# Altium project Arbitrary-Waveform-Generator.PrjPcb
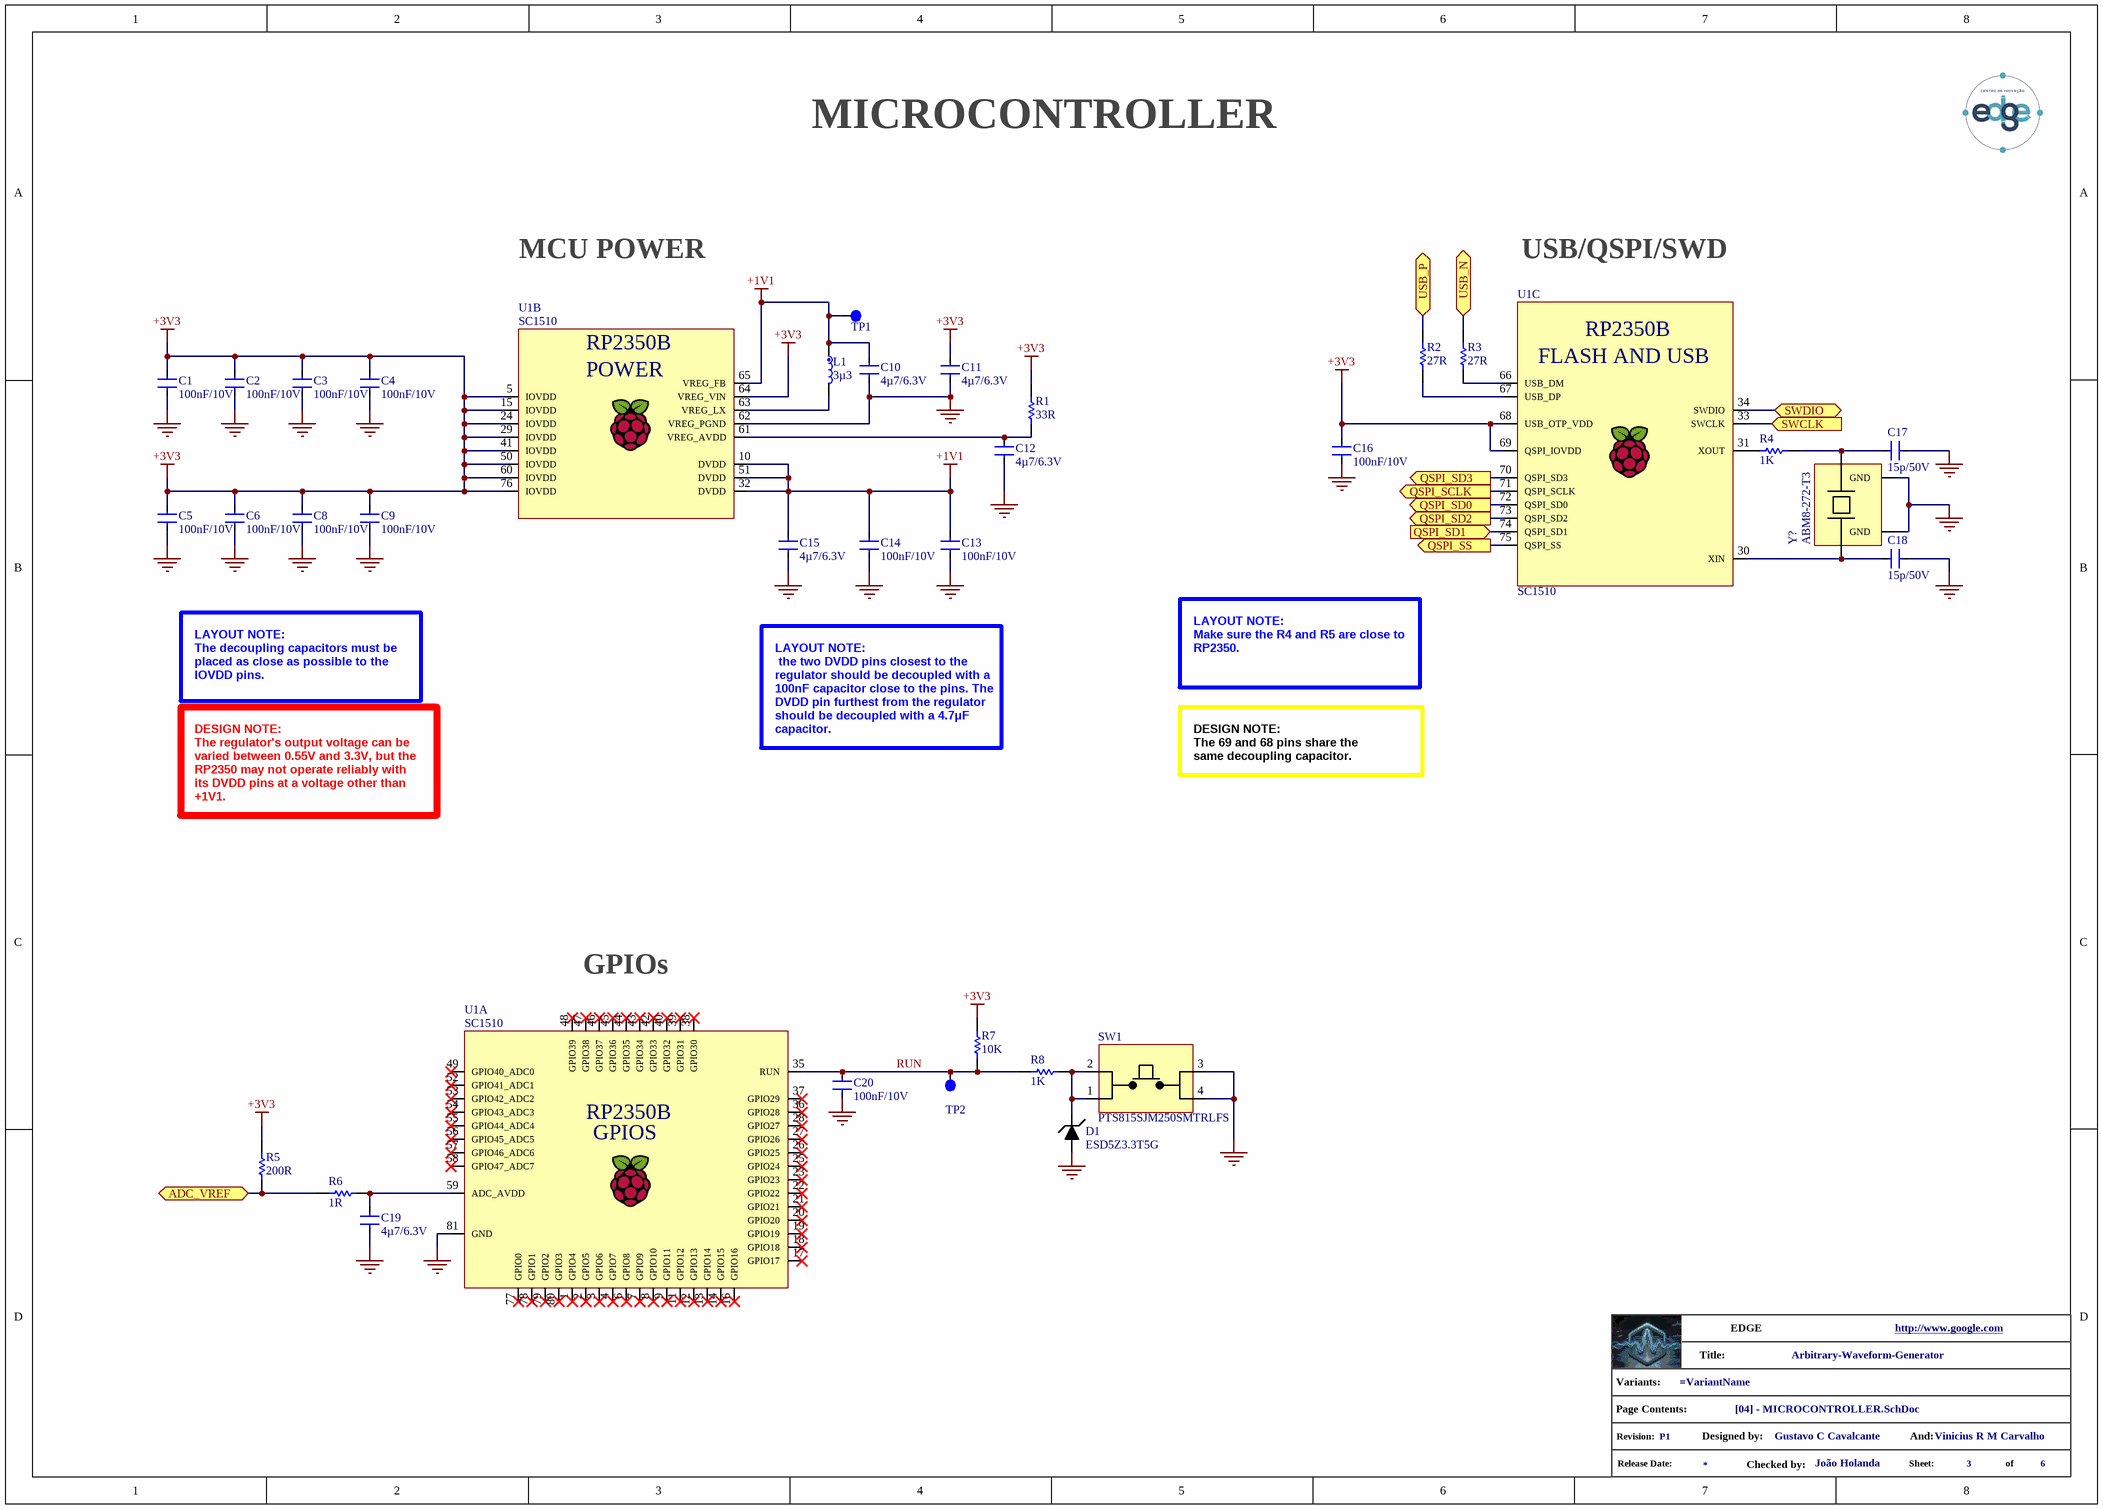
[diagram p0: [04] - MICROCONTROLLER.SchDoc]
Website: http://www.google.com; VersionRevision: P1; TitleProject: Arbitrary-Waveform-Generator; DesignedProject_2: Vinicius R M Carvalho; DesignedProject: Gustavo C Cavalcante; Company: EDGE; CheckedProject: João Holanda
5 sheets, 39 parts. Net scope: flat (ports and power ports of the same name join across sheets).
Board file: Arbitrary-Waveform-Generator.PcbDoc
Sheets:
  [04] - MICROCONTROLLER.SchDoc
  [05] - POWER SUPPLY.SchDoc
  Arbitrary-Waveform-Generator.SchDoc
    Designator = [02] - BLOCK DIAGRAM.SchDoc
    Designator = [01] - COVER PAGE.SchDoc

## Sheet [04] - MICROCONTROLLER.SchDoc
size A3; DocumentNumber: 3; SheetNumber: 3; SheetTotal: 6

### Parts
(Parts that share a designator on the sheet are numbered #1, #2 ... from top to bottom, then left to right.)
*?#1  info_project  (value not drawn)  (graphical)
C1  100nF/10V  [C0402]
C2  100nF/10V  [C0402]
C3  100nF/10V  [C0402]
C4  100nF/10V  [C0402]
C5  100nF/10V  [C0402]
C6  100nF/10V  [C0402]
C8  100nF/10V  [C0402]
C9  100nF/10V  [C0402]
C10  4µ7/6.3V  [C0402]
C11  4µ7/6.3V  [C0402]
C12  4µ7/6.3V  [C0402]
C13  100nF/10V  [C0402]
C14  100nF/10V  [C0402]
C15  4µ7/6.3V  [C0402]
C16  100nF/10V  [C0402]
C17  15p/50V  [C0402]
C18  15p/50V  [C0402]
C19  4µ7/6.3V  [C0402]
C20  100nF/10V  [C0402]
D1  ESD5Z3.3T5G  [TVS SOD-523]
L1  3µ3  [L0806 - RP2350]
R1  33R  [R0402]
R2  27R  [R0402]
R3  27R  [R0402]
R4  1K  [R0603]
R5  200R  [R0402]
R6  1R  [R0603]
R7  10K  [R0402]
R8  1K  [R0603]
SW1  PTS815SJM250SMTRLFS  [PTS526SK15SMTR2_LFS]
TP1  TestPoint  [Test Point]  (value not drawn)  (no BOM)
TP2  TestPoint  [Test Point]  (value not drawn)  (no BOM)
U1  SC1510  [SC1510]  (parts A,B,C of 3)
Y?  ABM8-272-T3  [ABM8-272-T3]

### Ports
ADC_VREF (bidir), QSPI_SCLK (out), QSPI_SD0 (out), QSPI_SD1 (in), QSPI_SD2 (out), QSPI_SD3 (out), QSPI_SS (out), SWCLK (in), SWDIO (bidir), USB_N (bidir), USB_P (bidir)

### Nets
+1V1: C10.1 C13.2 C14.2 C15.2 L1.1 TP1.1 U1.10(DVDD) U1.32(DVDD) U1.51(DVDD) U1.65(VREG_FB)
+3V3: C1.1 C2.1 C3.1 C4.2 C5.1 C6.1 C8.1 C9.2 C11.1 C16.1 R1.2 R5.2 R7.2 U1.5(IOVDD) U1.15(IOVDD) U1.24(IOVDD) U1.29(IOVDD) U1.41(IOVDD) U1.50(IOVDD) U1.60(IOVDD) U1.64(VREG_VIN) U1.68(USB_OTP_VDD) U1.69(QSPI_IOVDD) U1.76(IOVDD)
GND: C1.2 C2.2 C3.2 C4.1 C5.2 C6.2 C8.2 C9.1 C10.2 C11.2 C12.2 C13.1 C14.1 C15.1 C16.2 C17.1 C18.1 C19.2 C20.1 D1.2 SW1.3(NO_1) SW1.4(NO_2) U1.62(VREG_PGND) U1.81(GND) Y?.2(GND) Y?.4(GND)
RUN: C20.2 R7.1 R8.1 TP2.1 U1.35(RUN)
NetC12_1: C12.1 R1.1 U1.61(VREG_AVDD)
NetC17_2: C17.2 R4.2 Y?.3(C2)
NetC18_2: C18.2 U1.30(XIN) Y?.1(C1)
NetC19_1: C19.1 R6.1 U1.59(ADC_AVDD)
NetD1_1: D1.1 R8.2 SW1.1(COM_1) SW1.2(COM_2)
NetL1_2: L1.2 U1.63(VREG_LX)
NetR2_1: R2.1 U1.67(USB_DP)
NetR2_2: R2.2 ; port USB_P
NetR3_1: R3.1 U1.66(USB_DM)
NetR3_2: R3.2 ; port USB_N
NetR4_1: R4.1 U1.31(XOUT)
NetR5_1: R5.1 R6.2 ; port ADC_VREF
NetU1_33: U1.33(SWCLK) ; port SWCLK
NetU1_34: U1.34(SWDIO) ; port SWDIO
NetU1_70: U1.70(QSPI_SD3) ; port QSPI_SD3
NetU1_71: U1.71(QSPI_SCLK) ; port QSPI_SCLK
NetU1_72: U1.72(QSPI_SD0) ; port QSPI_SD0
NetU1_73: U1.73(QSPI_SD2) ; port QSPI_SD2
NetU1_74: U1.74(QSPI_SD1) ; port QSPI_SD1
NetU1_75: U1.75(QSPI_SS) ; port QSPI_SS

Not connected (* = marked no-connect by the designer): U1 1(GPIO4)* 2(GPIO5)* 3(GPIO6)* 4(GPIO7)* 6(GPIO8)* 7(GPIO9)* 8(GPIO10)* 9(GPIO11)* 11(GPIO12)* 12(GPIO13)* 13(GPIO14)* 14(GPIO15)* 16(GPIO16)* 17(GPIO17)* 18(GPIO18)* 19(GPIO19)* 20(GPIO20)* 21(GPIO21)* 22(GPIO22)* 23(GPIO23)* 25(GPIO24)* 26(GPIO25)* 27(GPIO26)* 28(GPIO27)* 36(GPIO28)* 37(GPIO29)* 38(GPIO30)* 39(GPIO31)* 40(GPIO32)* 42(GPIO33)* 43(GPIO34)* 44(GPIO35)* 45(GPIO36)* 46(GPIO37)* 47(GPIO38)* 48(GPIO39)* 49(GPIO40_ADC0)* 52(GPIO41_ADC1)* 53(GPIO42_ADC2)* 54(GPIO43_ADC3)* 55(GPIO44_ADC4)* 56(GPIO45_ADC5)* 57(GPIO46_ADC6)* 58(GPIO47_ADC7)* 77(GPIO0)* 78(GPIO1)* 79(GPIO2)* 80(GPIO3)*

### Notes on the sheet
- MICROCONTROLLER
- MCU POWER
- USB/QSPI/SWD
- LAYOUT NOTE:
  The decoupling capacitors must be placed as close as possible to the IOVDD pins.
- LAYOUT NOTE:
  Make sure the R4 and R5 are close to RP2350.
- LAYOUT NOTE:
  the two DVDD pins closest to the regulator should be decoupled with a 100nF capacitor close to the pins. The DVDD pin furthest from the regulator should be decoupled with a 4.7μF capacitor.
- DESIGN NOTE:
  The 69 and 68 pins share the same decoupling capacitor.
- DESIGN NOTE:
  The regulator's output voltage can be varied between 0.55V and 3.3V, but the RP2350 may not operate reliably with its DVDD pins at a voltage other than +1V1.
- (near U1) GPIOs
- (in symbol info_project) Title:; Variants:; Page Contents:; Revision:; Designed by:; And:; Release Date:; Checked by:; Sheet:; of
- (in symbol SC1510, part A) RP2350B; GPIOS
- (in symbol SC1510, part B) RP2350B; POWER
- (in symbol SC1510, part C) RP2350B; FLASH AND USB

### Library data of the parts
*?#1 = info_project: GRAPHICAL - Info Project
C1-C6 C8 C9 C13 C14 C16 C20 = CL05B104KP5NNNC: MLCC - 100nF 10V X7R 0402 ±10% Ceramic Capacitor; Manufacturer 1: Samsung; Multilayer: Yes; .Mounting: SMT; Supplier: Digikey; Supplier Part Number: 1276-1002-1-ND; RoHS: Yes; Category: Ceramic Capacitors; Stock: 29591550; Pricing: 1=0,08, 10=0,004, 100=0,0036, 1000=0,0032 (USD); Mounting Technology: Surface Mount; Pins: 2; Dielectric Material: Ceramic; Package Shape: Rectangular; Case/Package: 0402; Terminal Finish: Nickel; Min Operating Temperature: -55°C; Max Operating Temperature: 125°C; JESD-609 Code: e3; Value: 100nF; Capacitor Type: Ceramic; Tolerance  (fill in as +-): 10%; Package Style: SMTMeter; Packaging: Tape and Reel; Tolerance (fill in as +-): 10%; Rated DC Voltage (URdc): 10V; Temperature Characteristics Code: X7R; Termination: Wraparound; Length: 1mm; Width: 0.5mm; Height: 0.5mm; Reach SVHC Compliant: Yes; RoHS Compliant: Yes; ComponentLink1URL: https://datasheet.ciiva.com:443/pdfs/VipMasterIC/IC/SEMS/SEMS-S-A0008523115/SEMS-S-A0008523129-1.pdf?src-supplier=IHS+Markit; ComponentLink1Description: https://datasheet.ciiva.com:443/pdfs/VipMasterIC/IC/SEMS/SEMS-S-A0008523115/SEMS-S-A0008523129-1.pdf?src-supplier=IHS+Markit; ComponentLink2URL: https://datasheet.ciiva.com/15165/getdatasheetpartid-37100-15165107.pdf?src-supplier=Verical; ComponentLink2Description: https://datasheet.ciiva.com/15165/getdatasheetpartid-37100-15165107.pdf?src-supplier=Verical; ComponentLink3URL: https://datasheet.ciiva.com/16498/cl05b104kq5nnnc-16498491.pdf?src-supplier=Future+Electronics; ComponentLink3Description: https://datasheet.ciiva.com/16498/cl05b104kq5nnnc-16498491.pdf?src-supplier=Future+Electronics; .PCBChecked: *; .SCHChecked: *; Manufacturer Part Number 1: CL05B104KP5NNNC
C10-C12 C15 C19 = CL05A475KQ5NRNC: MLCC - 4.7 µF 6.3V 0402 X5R ±10%  Ceramic Capacitor X5R; Manufacturer 1: Samsung; Value: 4.7uF; Multilayer: Yes; .Mounting: SMT; Supplier: Digikey; Supplier Part Number: 1276-1481-1-ND; RoHS: Yes; Category: Ceramic Capacitors; Stock: 761086; Pricing: 1=0,08, 10=0,026, 100=0,016, 1000=0,0112, 2500=0,0096 (USD); Mounting Technology: Surface Mount; Pins: 2; Dielectric Material: Ceramic; Package Shape: Rectangular; Case/Package: 0402; Terminal Finish: Nickel; Min Operating Temperature: -55°C; Max Operating Temperature: 85°C; JESD-609 Code: e3; Capacitor Type: Ceramic; Tolerance  (fill in as +-): 10%; Packaging: Tape and Reel; Tolerance (fill in as +-): 10%; Rated DC Voltage (URdc): 6.3V; Temperature Characteristics Code: X5R; Termination: Wraparound; Reach SVHC Compliant: Yes; RoHS Compliant: Yes; ComponentLink1URL: https://datasheet.ciiva.com:443/pdfs/VipMasterIC/IC/SEMS/SEMS-S-A0008521219/SEMS-S-A0008521124-1.pdf?src-supplier=IHS+Markit; ComponentLink1Description: https://datasheet.ciiva.com:443/pdfs/VipMasterIC/IC/SEMS/SEMS-S-A0008521219/SEMS-S-A0008521124-1.pdf?src-supplier=IHS+Markit; ComponentLink2URL: https://datasheet.ciiva.com/25793/cl05a475kq5nrnc-25793634.pdf?src-supplier=Digikey; ComponentLink2Description: https://datasheet.ciiva.com/25793/cl05a475kq5nrnc-25793634.pdf?src-supplier=Digikey; ComponentLink3URL: https://datasheet.ciiva.com/26838/getdatasheetpartid-353228-26838196.pdf?src-supplier=Verical; ComponentLink3Description: https://datasheet.ciiva.com/26838/getdatasheetpartid-353228-26838196.pdf?src-supplier=Verical; .PCBChecked: *; .SCHChecked: *; Manufacturer Part Number 1: CL05A475KQ5NRNC
C17 C18 = GJM1555C1H150FB01D: MLCC - 15 pF 50V 0402 X5R ±1%  Ceramic Capacitor C0G, NP0; Manufacturer 1: Murata; Value: 15pF; Multilayer: Yes; .Mounting: SMT; Supplier: Digikey; Supplier Part Number: 490-11191-1-ND; Manufacturer Part Number 1: GJM1555C1H150FB01D; RoHS: Yes; Category: Ceramic Capacitors; Stock: 61415; Pricing: 1=0,13, 10=0,074, 100=0,0446, 1000=0,02973, 2500=0,02606, 5000=0,02385 (USD); Mounting Technology: Surface Mount; Pins: 2; Dielectric Material: Ceramic; Package Shape: Rectangular; Case/Package: 0402; Terminal Finish: Nickel; Min Operating Temperature: -55°C; Max Operating Temperature: 125°C; JESD-609 Code: e3; Capacitor Type: Ceramic; Tolerance  (fill in as +-): 1%; Packaging: Tape and Reel; Tolerance (fill in as +-): 1%; Rated DC Voltage (URdc): 50V; Temperature Characteristics Code: C0G; Termination: Wraparound; Reach SVHC Compliant: Yes; RoHS Compliant: Yes; ComponentLink1URL: https://datasheet.ciiva.com:443/pdfs/VipMasterIC/IC/MURE/MURE-S-A0004383799/MURE-S-A0004384018-1.pdf?src-supplier=IHS+Markit; ComponentLink1Description: https://datasheet.ciiva.com:443/pdfs/VipMasterIC/IC/MURE/MURE-S-A0004383799/MURE-S-A0004384018-1.pdf?src-supplier=IHS+Markit; ComponentLink2URL: https://datasheet.ciiva.com/11608/c02e-11608383.pdf?src-supplier=Avnet; ComponentLink2Description: https://datasheet.ciiva.com/11608/c02e-11608383.pdf?src-supplier=Avnet; .PCBChecked: *; .SCHChecked: *
D1 = ESD5Z3.3T5G: DIODE - TVS Unidirectional 158W, 3.3V V(RWM), Unidirectional, 1 Element, Silicon; Manufacturer 1: onsemi; Manufacturer Lifecycle Status: ACTIVE; Breakdown Voltage: 5V; Value: 105pF; Clamping Voltage: 14.1V; Forward Voltage: 1.1V; Max Junction Temperature (Tj): 150°C; Max Power Dissipation: 500mW; Number of Channels: 1; Peak Pulse Current: 11.2A; Peak Reverse Current: 50nA; Power Line Protection: No; .Mounting: SMT; Supplier: Avnet; Supplier Part Number: ESD5Z3.3T5G; Manufacturer Part Number 1: ESD5Z3.3T5G; RoHS: Compliant; Category: TVS Diodes; Stock: 16000; Pricing: 8000=0,01659, 16000=0,01601, 32000=0,01578, 64000=0,01554, 128000=0,01531 (USD); China RoHS: Compliant; Composition: Zener; Country of Origin: Mainland China; Direction: Unidirectional; Export Control Classification Number (ECCN) Code: EAR99; Height: 700µm; Harmonized Tariff Schedule (HTS) Code: 8541.10.00.50; Introduction Date: 2014-12-18; Lead Free: Lead Free; Lifecycle Status: Production; Max Operating Temperature: 150°C; Min Breakdown Voltage: 5V; Min Operating Temperature: -55°C; Mounting Technology: Surface Mount; Number of Elements: 1; Number of Terminals: 2; Number of Unidirectional Channels: 1; Packaging: Tape & Reel (TR); Peak Pulse Power: 158W; Polarity: Unidirectional; REACH SVHC: Yes; Reverse Standoff Voltage: 3.3V; Schedule B: 8536300000, 8536300000|8536300000|8536300000|8536300000|8536300000|8536300000|8536300000|8536300000|8536300000|8536300000|8536300000|8536300000|8536300000|8536300000|8536300000|8536300000|8536300000|8536300000|8536300000|8536300000|8536300000|8536300000|8536300000|85; ComponentLink1URL: https://datasheet.octopart.com:443/ESD5Z3.3T5G-onsemi-datasheet-156001415.pdf?src-supplier=Upverter; ComponentLink1Description: https://datasheet.octopart.com:443/ESD5Z3.3T5G-onsemi-datasheet-156001415.pdf?src-supplier=Upverter; ComponentLink2URL: https://sigma.octopart.com:443/138897313/technical_drawing/onsemi-ESD5Z3.3T5G.pdf?src-supplier=Upverter; ComponentLink2Description: https://sigma.octopart.com:443/138897313/technical_drawing/onsemi-ESD5Z3.3T5G.pdf?src-supplier=Upverter; ComponentLink3URL: https://datasheet.octopart.com:443/ESD5Z3.3T5G-ON-Semiconductor-datasheet-127822404.pdf?src-supplier=JRH+Electronics; ComponentLink3Description: https://datasheet.octopart.com:443/ESD5Z3.3T5G-ON-Semiconductor-datasheet-127822404.pdf?src-supplier=JRH+Electronics; ComponentLink4URL: https://datasheet.octopart.com:443/ESD5Z3.3T5G-onsemi-datasheet-180958859.pdf?src-supplier=IHS; ComponentLink4Description: https://datasheet.octopart.com:443/ESD5Z3.3T5G-onsemi-datasheet-180958859.pdf?src-supplier=IHS; ComponentLink5URL: https://datasheet.octopart.com:443/ESD5Z3.3T5G-ON-Semiconductor-datasheet-11544130.pdf?src-supplier=HQonline; ComponentLink5Description: https://datasheet.octopart.com:443/ESD5Z3.3T5G-ON-Semiconductor-datasheet-11544130.pdf?src-supplier=HQonline; ComponentLink6URL: https://datasheet.octopart.com:443/ESD5Z3.3T5G-ON-Semiconductor-datasheet-8374493.pdf?src-supplier=HQonline; ComponentLink6Description: https://datasheet.octopart.com:443/ESD5Z3.3T5G-ON-Semiconductor-datasheet-8374493.pdf?src-supplier=HQonline; ComponentLink7URL: http://sigma.octopart.com:80/150607520/rohs_statement/ON-Semiconductor-ESD5Z3.3T5G.pdf?src-supplier=Compliance+Statements; ComponentLink7Description: http://sigma.octopart.com:80/150607520/rohs_statement/ON-Semiconductor-ESD5Z3.3T5G.pdf?src-supplier=Compliance+Statements; ComponentLink8URL: http://sigma.octopart.com:80/reach_statement/ON-Semiconductor-company-79.pdf?src-supplier=Compliance+Statements; ComponentLink8Description: http://sigma.octopart.com:80/reach_statement/ON-Semiconductor-company-79.pdf?src-supplier=Compliance+Statements; ComponentLink9URL: https://octopart.com:443/opatz8j6/c1?t=izMJ927EJ8p-vcFp5YiULQP89YROXcgUMjLmfmcFrpsLORjeOAHbDnjkAelN0Ccy0gL0LVpk3z7ylT2K2S_eP-mhMeDz_6KLNMwQQt2JPDbBX7ZEh_kk6kCGoHagiDdBFf3dpvGzjPU23skgYPTnTPg2IetNQSHciHS3q0nynv9xUsUTYHxnXoWRQ86cWS_m5b24JJA9evMkwr2Dw7tLyHPUfneyFhWmn2UWy_C5IcbbmGTHgutJVJXGbP89y7-MwYwx7M9iAbKfnJejLc5lZu9O7V3xIF0rv_DfhpYiMPxZcOB6iyeZUBbKne4vBzgX8XCPFHWxn1stSoXP-Cb67GHmV6Dj1N_luS4MSTA1&src-supplier=Compliance+Statements; ComponentLink9Description: https://octopart.com:443/opatz8j6/c1?t=izMJ927EJ8p-vcFp5YiULQP89YROXcgUMjLmfmcFrpsLORjeOAHbDnjkAelN0Ccy0gL0LVpk3z7ylT2K2S_eP-mhMeDz_6KLNMwQQt2JPDbBX7ZEh_kk6kCGoHagiDdBFf3dpvGzjPU23skgYPTnTPg2IetNQSHciHS3q0nynv9xUsUTYHxnXoWRQ86cWS_m5b24JJA9evMkwr2Dw7tLyHPUfneyFhWmn2UWy_C5IcbbmGTHgutJVJXGbP89y7-MwYwx7M9iAbKfnJejLc5lZu9O7V3xIF0rv_DfhpYiMPxZcOB6iyeZUBbKne4vBzgX8XCPFHWxn1stSoXP-Cb67GHmV6Dj1N_luS4MSTA1&src-supplier=Compliance+Statements; ComponentLink10URL: https://octopart.com:443/opatz8j6/c1?t=_uGKssuZfXRRtjtX180N_qWdcIt0v4F6lOQUvzaI46hSl3nAqZDDMX2UHKBeo7D2kA6LsuiEEwZyf3Ua3kiJ_ikYDAoT8c1T0hSAdbpM6QyYA1LKfiBLC4scZWlvUOKQXtJim9A-xA8kassgbVsb57NiOjfCQqUdJrisx1r_Uu9ySZt_3i7TUCfM0AKct0r58UhqjoUoY-T_JaW4FteN8BuaEOjLDU9OIB6jVR6Z_r_Os1TSPRbWl4jdbImrPlx3nRnl-oFy4TxsoO7zPi4V6ySUu5PEHb8ZSfG45jmBuZ4EdDwgHoudRCV7fbemR_p8sMk7qC-CSK5khPxG8Zcx20D1yPzuFm2WN9pjHsF0pg&src-supplier=Compliance+Statements; ComponentLink10Description: https://octopart.com:443/opatz8j6/c1?t=_uGKssuZfXRRtjtX180N_qWdcIt0v4F6lOQUvzaI46hSl3nAqZDDMX2UHKBeo7D2kA6LsuiEEwZyf3Ua3kiJ_ikYDAoT8c1T0hSAdbpM6QyYA1LKfiBLC4scZWlvUOKQXtJim9A-xA8kassgbVsb57NiOjfCQqUdJrisx1r_Uu9ySZt_3i7TUCfM0AKct0r58UhqjoUoY-T_JaW4FteN8BuaEOjLDU9OIB6jVR6Z_r_Os1TSPRbWl4jdbImrPlx3nRnl-oFy4TxsoO7zPi4V6ySUu5PEHb8ZSfG45jmBuZ4EdDwgHoudRCV7fbemR_p8sMk7qC-CSK5khPxG8Zcx20D1yPzuFm2WN9pjHsF0pg&src-supplier=Compliance+Statements
L1 = AOTA-B201610S3R3-101-T: IND - 3.3 µH 2.1A 0806 140mOhm Shielded Molded Inductor  Max 0806 (2016 Metric); Manufacturer 1: Abracon; .Mounting: SMT; Supplier: Digikey; Supplier Part Number: 535-AOTA-B201610S3R3-101-TCT-ND; RoHS: No; Stock: 2887; Pricing: 1=0,22, 10=0,181, 100=0,1497, 1000=0,12251 (USD); .PCBChecked: *; .SCHChecked: *; Manufacturer Part Number 1: AOTA-B201610S3R3-101-T
R1 = ERJ-2RKF33R0X: RES - 33R 1/10W 0402 ±1%  Chip Resistor; Manufacturer 1: Panasonic; Power: 100mW; Rated Temperature: 70°C; Working Voltage: 50V; Temperature Coefficient (ppm/Cel): 100; Package Height: 0.35mm; Package Length: 1mm; Package Width: 0.5mm; Reference Standard: AEC-Q200; .Mounting: SMT; Supplier: Digikey; Supplier Part Number: P33.0LCT-ND; RoHS: Yes; Category: Chip SMD Resistors; Stock: 66806; Pricing: 1=0,1, 10=0,028, 100=0,0138, 1000=0,00766, 2500=0,00632, 5000=0,00554 (USD); Mounting Technology: Surface Mount; Pins: 2; Package Shape: Rectangular; Case/Package: 0402; Terminal Finish: Nickel; Min Operating Temperature: -55°C; Max Operating Temperature: 155°C; Tolerance: 1%; JESD-609 Code: e3; Resistor Type: FIXED RESISTOR; Construction: Rectangular; Packaging: Tape and Reel; Value: 33R; Technology: METAL GLAZE/THICK FILM; Termination: Wraparound; Reach SVHC Compliant: Yes; RoHS Compliant: Yes; ComponentLink1URL: https://datasheet.ciiva.com:443/pdfs/VipMasterIC/IC/PANA/PANA-S-A0009889626/PANA-S-A0009889626-1.pdf?src-supplier=IHS+Markit; ComponentLink1Description: https://datasheet.ciiva.com:443/pdfs/VipMasterIC/IC/PANA/PANA-S-A0009889626/PANA-S-A0009889626-1.pdf?src-supplier=IHS+Markit; ComponentLink2URL: https://datasheet.ciiva.com/11821/0900766b80f80784-11821292.pdf?src-supplier=Rs; ComponentLink2Description: https://datasheet.ciiva.com/11821/0900766b80f80784-11821292.pdf?src-supplier=Rs; ComponentLink3URL: https://datasheet.ciiva.com/5917/aoa0000ce2-5917817.pdf?src-supplier=Farnell; ComponentLink3Description: https://datasheet.ciiva.com/5917/aoa0000ce2-5917817.pdf?src-supplier=Farnell; ComponentLink4URL: https://datasheet.ciiva.com/43467/1678782-43467173.pdf?src-supplier=Farnell; ComponentLink4Description: https://datasheet.ciiva.com/43467/1678782-43467173.pdf?src-supplier=Farnell; ComponentLink5URL: https://datasheet.ciiva.com/9190/aoa0000ce2-9190507.pdf?src-supplier=Avnet; ComponentLink5Description: https://datasheet.ciiva.com/9190/aoa0000ce2-9190507.pdf?src-supplier=Avnet; ComponentLink6URL: https://datasheet.ciiva.com/24023/aoa0000ce2-24023999.pdf?src-supplier=Mouser; ComponentLink6Description: https://datasheet.ciiva.com/24023/aoa0000ce2-24023999.pdf?src-supplier=Mouser; ComponentLink7URL: https://datasheet.ciiva.com/46373/1678782-46373081.pdf?src-supplier=Element14; ComponentLink7Description: https://datasheet.ciiva.com/46373/1678782-46373081.pdf?src-supplier=Element14; ComponentLink8URL: https://datasheet.ciiva.com/46373/1678782-46373082.pdf?src-supplier=Element14; ComponentLink8Description: https://datasheet.ciiva.com/46373/1678782-46373082.pdf?src-supplier=Element14; ComponentLink9URL: https://datasheet.ciiva.com/7836/aoa0000ce2-7836490.pdf?src-supplier=Element14; ComponentLink9Description: https://datasheet.ciiva.com/7836/aoa0000ce2-7836490.pdf?src-supplier=Element14; ComponentLink10URL: https://datasheet.ciiva.com/7836/426256-7836813.pdf?src-supplier=Element14; ComponentLink10Description: https://datasheet.ciiva.com/7836/426256-7836813.pdf?src-supplier=Element14; ComponentLink11URL: https://datasheet.ciiva.com/16777/70260748-16777705.pdf?src-supplier=Allied+Electronics; ComponentLink11Description: https://datasheet.ciiva.com/16777/70260748-16777705.pdf?src-supplier=Allied+Electronics; .PCBChecked: *; .SCHChecked: *; Manufacturer Part Number 1: ERJ-2RKF33R0X
R2 R3 = ERJ-2RKF27R0X: RES- 27R 1/10W  0402 ±1% 0.1W Chip Resistor; Manufacturer 1: Panasonic; Power: 100mW; Rated Temperature: 70°C; Working Voltage: 50V; Temperature Coefficient (ppm/Cel): 100; Package Height: 0.35mm; Package Length: 1mm; Package Width: 0.5mm; Reference Standard: AEC-Q200; .Mounting: SMT; Supplier: Digikey; Supplier Part Number: P27.0LCT-ND; RoHS: Yes; Category: Chip SMD Resistors; Stock: 682991; Pricing: 1=0,1, 10=0,028, 100=0,0138, 1000=0,00766, 2500=0,00632, 5000=0,00554 (USD); Mounting Technology: Surface Mount; Pins: 2; Package Shape: Rectangular; Case/Package: 0402; Terminal Finish: Nickel; Min Operating Temperature: -55°C; Max Operating Temperature: 155°C; Tolerance: 1%; JESD-609 Code: e3; Resistor Type: FIXED RESISTOR; Construction: Rectangular; Packaging: Tape and Reel; Value: 27R; Technology: METAL GLAZE/THICK FILM; Termination: Wraparound; Reach SVHC Compliant: Yes; RoHS Compliant: Yes; ComponentLink1URL: https://datasheet.ciiva.com:443/pdfs/VipMasterIC/IC/PANA/PANA-S-A0009889626/PANA-S-A0009889626-1.pdf?src-supplier=IHS+Markit; ComponentLink1Description: https://datasheet.ciiva.com:443/pdfs/VipMasterIC/IC/PANA/PANA-S-A0009889626/PANA-S-A0009889626-1.pdf?src-supplier=IHS+Markit; ComponentLink2URL: https://datasheet.ciiva.com/11821/0900766b80f80784-11821276.pdf?src-supplier=Rs; ComponentLink2Description: https://datasheet.ciiva.com/11821/0900766b80f80784-11821276.pdf?src-supplier=Rs; ComponentLink3URL: https://datasheet.ciiva.com/46373/1678782-46373578.pdf?src-supplier=Element14; ComponentLink3Description: https://datasheet.ciiva.com/46373/1678782-46373578.pdf?src-supplier=Element14; ComponentLink4URL: https://datasheet.ciiva.com/46373/1678782-46373579.pdf?src-supplier=Element14; ComponentLink4Description: https://datasheet.ciiva.com/46373/1678782-46373579.pdf?src-supplier=Element14; ComponentLink5URL: https://datasheet.ciiva.com/22681/1678782-22681159.pdf?src-supplier=Element14; ComponentLink5Description: https://datasheet.ciiva.com/22681/1678782-22681159.pdf?src-supplier=Element14; ComponentLink6URL: https://datasheet.ciiva.com/7891/aoa0000ce2-7891306.pdf?src-supplier=Element14; ComponentLink6Description: https://datasheet.ciiva.com/7891/aoa0000ce2-7891306.pdf?src-supplier=Element14; ComponentLink7URL: https://datasheet.ciiva.com/7891/426256-7891578.pdf?src-supplier=Element14; ComponentLink7Description: https://datasheet.ciiva.com/7891/426256-7891578.pdf?src-supplier=Element14; ComponentLink8URL: https://datasheet.ciiva.com/9191/aoa0000ce2-9191129.pdf?src-supplier=Avnet; ComponentLink8Description: https://datasheet.ciiva.com/9191/aoa0000ce2-9191129.pdf?src-supplier=Avnet; ComponentLink9URL: https://datasheet.ciiva.com/9191/aoa0000ce2-9191130.pdf?src-supplier=Avnet; ComponentLink9Description: https://datasheet.ciiva.com/9191/aoa0000ce2-9191130.pdf?src-supplier=Avnet; ComponentLink10URL: https://datasheet.ciiva.com/43467/1678782-43467165.pdf?src-supplier=Farnell; ComponentLink10Description: https://datasheet.ciiva.com/43467/1678782-43467165.pdf?src-supplier=Farnell; .PCBChecked: *; .SCHChecked: *; Manufacturer Part Number 1: ERJ-2RKF27R0X
R4 R8 = RMCF0603FT1K00: RES - 1K 1/10W 0603  ±1%; Manufacturer 1: Stackpole Electronics; Power: 100mW; Rated Temperature: 70°C; Value: 1kR; Working Voltage: 75V; Temperature Coefficient (ppm/Cel): 100; Package Height: 0.45mm; Package Length: 1.55mm; Package Width: 0.8mm; Reference Standard: AEC-Q200; .Mounting: SMT; Supplier: Digikey; Supplier Part Number: RMCF0603FT1K00CT-ND; RoHS: Yes; Category: Chip SMD Resistors; Stock: 2369156; Pricing: 1=0,1, 10=0,02, 100=0,0091, 1000=0,0048, 2500=0,00386 (USD); Mounting Technology: Surface Mount; Pins: 2; Package Shape: Rectangular; Case/Package: 0603; Terminal Finish: Nickel; Min Operating Temperature: -55°C; Max Operating Temperature: 155°C; Tolerance: 1%; JESD-609 Code: e3; Resistor Type: FIXED RESISTOR; Construction: Rectangular; Packaging: Tape and Reel; Technology: METAL GLAZE/THICK FILM; Termination: Wraparound; Reach SVHC Compliant: Yes; RoHS Compliant: Yes; ComponentLink1URL: https://datasheet.ciiva.com:443/pdfs/VipMasterIC/IC/SEIE/SEIE-S-A0009541969/SEIE-S-A0009541969-1.pdf?src-supplier=IHS+Markit; ComponentLink1Description: https://datasheet.ciiva.com:443/pdfs/VipMasterIC/IC/SEIE/SEIE-S-A0009541969/SEIE-S-A0009541969-1.pdf?src-supplier=IHS+Markit; ComponentLink2URL: https://www.seielect.com/catalog/SEI-Packaging.pdf?src-supplier=Avnet; ComponentLink2Description: https://www.seielect.com/catalog/SEI-Packaging.pdf?src-supplier=Avnet; ComponentLink3URL: https://www.seielect.com/catalog/SEI-RMCF_RMCP.pdf?src-supplier=Avnet; ComponentLink3Description: https://www.seielect.com/catalog/SEI-RMCF_RMCP.pdf?src-supplier=Avnet; ComponentLink4URL: https://www.seielect.com/catalog/sei-rmcf_rmcp.pdf?src-supplier=Digikey; ComponentLink4Description: https://www.seielect.com/catalog/sei-rmcf_rmcp.pdf?src-supplier=Digikey; ComponentLink5URL: http://www.seielect.com/Catalog/SEI-rmc.pdf?src-supplier=Future+Electronics; ComponentLink5Description: http://www.seielect.com/Catalog/SEI-rmc.pdf?src-supplier=Future+Electronics; ComponentLink6URL: https://datasheet.octopart.com/RMCF0603FT1K00-Stackpole-Electronics-datasheet-11547379.pdf?src-supplier=Future+Electronics; ComponentLink6Description: https://datasheet.octopart.com/RMCF0603FT1K00-Stackpole-Electronics-datasheet-11547379.pdf?src-supplier=Future+Electronics; ComponentLink7URL: https://www.seielect.com/catalog/SEI-Packaging.pdf?src-supplier=Arrow+Electronics; ComponentLink7Description: https://www.seielect.com/catalog/SEI-Packaging.pdf?src-supplier=Arrow+Electronics; ComponentLink8URL: https://www.seielect.com/catalog/SEI-Packaging.pdf?src-supplier=Verical; ComponentLink8Description: https://www.seielect.com/catalog/SEI-Packaging.pdf?src-supplier=Verical; ComponentLink9URL: https://www.seielect.com/catalog/SEI-Packaging.pdf?src-supplier=Quest; ComponentLink9Description: https://www.seielect.com/catalog/SEI-Packaging.pdf?src-supplier=Quest; ComponentLink10URL: https://datasheet.octopart.com/RMCF0603FT1K00-Stackpole-Electronics-datasheet-155966809.pdf?src-supplier=Electro+Sonic; ComponentLink10Description: https://datasheet.octopart.com/RMCF0603FT1K00-Stackpole-Electronics-datasheet-155966809.pdf?src-supplier=Electro+Sonic; ComponentLink11URL: https://datasheet.octopart.com/RMCF0603FT1K00-Stackpole-Electronics-datasheet-155966809.pdf?src-supplier=Master+Electronics; ComponentLink11Description: https://datasheet.octopart.com/RMCF0603FT1K00-Stackpole-Electronics-datasheet-155966809.pdf?src-supplier=Master+Electronics; .PCBChecked: *; .SCHChecked: *; Manufacturer Part Number 1: RMCF0603FT1K00
R5 = RT0402BRD07200RL: RES - 200R  0.0625W 0402 0.1%  50V Fixed Resistor, Thin Film; Manufacturer 1: Yageo; Additional Feature: HIGH PRECISION; Power: 62.5mW; Rated Temperature: 70°C; Temperature Coefficient (ppm/Cel): 25; Package Height: 0.3mm; Package Length: 1mm; Package Width: 0.5mm; .Mounting: SMT; Supplier: Avnet; Supplier Part Number: 49AK4062; RoHS: Yes; Category: Chip SMD Resistors; Stock: 8493; Pricing: 1=0,198, 25=0,135, 100=0,098, 250=0,087, 500=0,077 (USD); Mounting Technology: Surface Mount; Pins: 2; Case/Package: 0402; Min Operating Temperature: -55°C; Max Operating Temperature: 155°C; Tolerance: 0.1%; Resistor Type: FIXED RESISTOR; Construction: Chip; Packaging: Tape and Reel; Value: 200R; Technology: THIN FILM; Termination: Wraparound; Working Voltage: 50V; Reach SVHC Compliant: Yes; RoHS Compliant: Yes; ComponentLink1URL: https://datasheet.ciiva.com:443/pdfs/VipMasterIC/IC/YAGO/YAGO-S-A0008510989/YAGO-S-A0008510989-1.pdf?src-supplier=IHS+Markit; ComponentLink1Description: https://datasheet.ciiva.com:443/pdfs/VipMasterIC/IC/YAGO/YAGO-S-A0008510989/YAGO-S-A0008510989-1.pdf?src-supplier=IHS+Markit; ComponentLink2URL: https://datasheet.ciiva.com/12705/pyu-rt-1-to-0-05-rohs-l-4-12705967.pdf?src-supplier=Mouser; ComponentLink2Description: https://datasheet.ciiva.com/12705/pyu-rt-1-to-0-05-rohs-l-4-12705967.pdf?src-supplier=Mouser; ComponentLink3URL: https://datasheet.ciiva.com/46635/pyu-rt-1-to-0-05-rohs-l-5-46635174.pdf?src-supplier=Digikey; ComponentLink3Description: https://datasheet.ciiva.com/46635/pyu-rt-1-to-0-05-rohs-l-5-46635174.pdf?src-supplier=Digikey; ComponentLink4URL: https://datasheet.ciiva.com/2582/pyu-rt-1-to-0-05-rohs-l-4-2582220.pdf?src-supplier=Digikey; ComponentLink4Description: https://datasheet.ciiva.com/2582/pyu-rt-1-to-0-05-rohs-l-4-2582220.pdf?src-supplier=Digikey; .SCHChecked: *; .PCBChecked: *; Manufacturer Part Number 1: RT0402BRD07200RL
R6 = RC0603FR-071RL: RES - 1R 1/10W  0603 ±1%; Manufacturer 1: Yageo; Additional Feature: LASER TRIMMABLE; Power: 100mW; Rated Temperature: 70°C; Working Voltage: 75V; Temperature Coefficient (ppm/Cel): 200; Package Height: 0.45mm; Package Length: 1.6mm; Package Width: 0.8mm; .Mounting: SMT; Supplier: Digikey; Supplier Part Number: 311-1.00HRCT-ND; RoHS: Yes; Category: Chip SMD Resistors; Stock: 71794; Pricing: 1=0,11, 10=0,012, 100=0,0112, 1000=0,0102 (USD); Mounting Technology: Surface Mount; Pins: 2; Package Shape: Rectangular; Case/Package: 0603; Terminal Finish: Nickel; Min Operating Temperature: -55°C; Max Operating Temperature: 155°C; Tolerance: 1%; JESD-609 Code: e3; Resistor Type: FIXED RESISTOR; Construction: Chip; Packaging: Tape and Reel; Value: 1R; Technology: METAL GLAZE/THICK FILM; Termination: Wraparound; Reach SVHC Compliant: Yes; RoHS Compliant: Yes; ComponentLink1URL: https://datasheet.ciiva.com:443/pdfs/VipMasterIC/IC/YAGO/YAGO-S-A0008145938/YAGO-S-A0008145938-1.pdf?src-supplier=IHS+Markit; ComponentLink1Description: https://datasheet.ciiva.com:443/pdfs/VipMasterIC/IC/YAGO/YAGO-S-A0008145938/YAGO-S-A0008145938-1.pdf?src-supplier=IHS+Markit; ComponentLink2URL: https://datasheet.ciiva.com/11808/0900766b80f96399-11808162.pdf?src-supplier=Rs; ComponentLink2Description: https://datasheet.ciiva.com/11808/0900766b80f96399-11808162.pdf?src-supplier=Rs; ComponentLink3URL: https://datasheet.ciiva.com/6547/pyu-r-int-thick-7-6547270.pdf?src-supplier=Digikey; ComponentLink3Description: https://datasheet.ciiva.com/6547/pyu-r-int-thick-7-6547270.pdf?src-supplier=Digikey; ComponentLink4URL: https://datasheet.ciiva.com/6547/pyu-r-int-thick-7-6547271.pdf?src-supplier=Digikey; ComponentLink4Description: https://datasheet.ciiva.com/6547/pyu-r-int-thick-7-6547271.pdf?src-supplier=Digikey; ComponentLink5URL: https://datasheet.ciiva.com/7746/1738695-7746296.pdf?src-supplier=Element14; ComponentLink5Description: https://datasheet.ciiva.com/7746/1738695-7746296.pdf?src-supplier=Element14; ComponentLink6URL: https://datasheet.ciiva.com/7746/1738695-7746297.pdf?src-supplier=Element14; ComponentLink6Description: https://datasheet.ciiva.com/7746/1738695-7746297.pdf?src-supplier=Element14; ComponentLink7URL: https://datasheet.ciiva.com/6547/pyu-r-int-thick-7-6547269.pdf?src-supplier=Digikey; ComponentLink7Description: https://datasheet.ciiva.com/6547/pyu-r-int-thick-7-6547269.pdf?src-supplier=Digikey; .PCBChecked: *; .SCHChecked: *; Manufacturer Part Number 1: RC0603FR-071RL
R7 = RC1005F103CS: RES - 10K 1/16W 0402 ±1% Chip Resistor; Manufacturer 1: Samsung; Power: 60mW; Value: 10kR; Working Voltage: 50V; Temperature Coefficient (ppm/Cel): 100; Package Height: 0.35mm; Package Length: 1mm; Package Width: 0.5mm; .Mounting: SMT; Supplier: Digikey; Supplier Part Number: 1276-3431-1-ND; Manufacturer Part Number 1: RC1005F103CS; RoHS: Yes; Category: Chip SMD Resistors; Stock: 10935408; Pricing: 1=0,1, 10=0,039, 100=0,0201, 1000=0,01175, 2500=0,0099, 5000=0,00882 (USD); Mounting Technology: Surface Mount; Pins: 2; Package Shape: Rectangular; Case/Package: 0402; Terminal Finish: Nickel; Min Operating Temperature: -55°C; Max Operating Temperature: 125°C; Tolerance: 1%; JESD-609 Code: e3; Resistor Type: FIXED RESISTOR; Construction: Chip; Packaging: Tape and Reel; Technology: METAL GLAZE/THICK FILM; Reach SVHC Compliant: Yes; RoHS Compliant: Yes; ComponentLink1URL: https://datasheet.ciiva.com:443/pdfs/VipMasterIC/IC/SEMS/SEMS-S-A0001326806/SEMS-S-A0001326806-1.pdf?src-supplier=IHS+Markit; ComponentLink1Description: https://datasheet.ciiva.com:443/pdfs/VipMasterIC/IC/SEMS/SEMS-S-A0001326806/SEMS-S-A0001326806-1.pdf?src-supplier=IHS+Markit; ComponentLink2URL: https://datasheet.ciiva.com/15196/getdatasheetpartid-504789-15196214.pdf?src-supplier=Verical; ComponentLink2Description: https://datasheet.ciiva.com/15196/getdatasheetpartid-504789-15196214.pdf?src-supplier=Verical; ComponentLink3URL: https://datasheet.ciiva.com/16481/rcseries-16481007.pdf?src-supplier=Future+Electronics; ComponentLink3Description: https://datasheet.ciiva.com/16481/rcseries-16481007.pdf?src-supplier=Future+Electronics; .PCBChecked: *; .SCHChecked: *
SW1 = PTS815SJM250SMTRLFS: SWITCH - Tactile Switch SPST-NO Top Actuated Surface Mount; Manufacturer 1: ITT C&K; .Mounting: SMT; Supplier: Digikey; Supplier Part Number: CKN12215-1-ND; Manufacturer Part Number 1: PTS815SJM250SMTRLFS; RoHS: Yes; Category: Tactile Switches; Stock: 10550; Pricing: 1=0,22, 10=0,191, 25=0,1788, 100=0,1606, 250=0,14892, 500=0,14052, 1000=0,13263 (USD); ComponentLink1URL: https://datasheet.octopart.com/PTS815-SJM-250-SMTR-LFS-C%26K-Components-datasheet-175421037.pdf?src-supplier=Element14; ComponentLink1Description: https://datasheet.octopart.com/PTS815-SJM-250-SMTR-LFS-C%26K-Components-datasheet-175421037.pdf?src-supplier=Element14; ComponentLink2URL: https://dznh3ojzb2azq.cloudfront.net/products/Tactile/PTS815/documents/datasheet.pdf?src-supplier=Digikey; ComponentLink2Description: https://dznh3ojzb2azq.cloudfront.net/products/Tactile/PTS815/documents/datasheet.pdf?src-supplier=Digikey; ComponentLink3URL: https://datasheet.octopart.com/PTS815-SJM-250-SMTR-LFS-C%26K-Components-datasheet-175421037.pdf?src-supplier=Farnell; ComponentLink3Description: https://datasheet.octopart.com/PTS815-SJM-250-SMTR-LFS-C%26K-Components-datasheet-175421037.pdf?src-supplier=Farnell; ComponentLink4URL: https://datasheet.octopart.com/PTS815SJM250SMTRLFS-C%26K-Components-datasheet-166147782.pdf?src-supplier=TME; ComponentLink4Description: https://datasheet.octopart.com/PTS815SJM250SMTRLFS-C%26K-Components-datasheet-166147782.pdf?src-supplier=TME; .SCHChecked: *; .PCBChecked: *
TP1 TP2 = Test_Point: MECH - Test Points
U1 = SC1510: IC - MCU - ARM Microcontrollers - MCU RP2350B 150MHz clock Dual Arm Cortex-M33 cores 520KB RAM 8KB on-chip QFN-80; Manufacturer 1: RASPBERRY-PI; .Mounting: SMT; Datasheet Link: https://datasheets.raspberrypi.com/rp2350/rp2350-datasheet.pdf; Height: 0.9mm; Mouser Part Number: 358-SC1510; Mouser Price/Stock: https://www.mouser.co.uk/ProductDetail/Raspberry-Pi/SC1510?qs=jcD%2FCkGBYePv%252BTwvNgU%2F3g%3D%3D; .SCHChecked: *; .PCBChecked: *; Manufacturer Part Number 1: SC1510
Y? = ABM8-272-T3: IC - CRYSTAL 12 MHz ±30ppm Crystal 10pF 50 Ohms 4-SMD, No Lead; Manufacturer 1: ABRACON; .Mounting: SMT; Datasheet Link: https://abracon.com/datasheets/ABM8-272-T3.pdf; Height: 0.8mm; Mouser Part Number: 815-ABM8-272-T3; Mouser Price/Stock: https://www.mouser.co.uk/ProductDetail/ABRACON/ABM8-272-T3?qs=QpmGXVUTftEj6miOiJBMxQ%3D%3D; .PCBChecked: *; .SCHChecked: *; Manufacturer Part Number 1: ABM8-272-T3

## Sheet [05] - POWER SUPPLY.SchDoc
size A3; DocumentNumber: 4; SheetNumber: 4; SheetTotal: 6
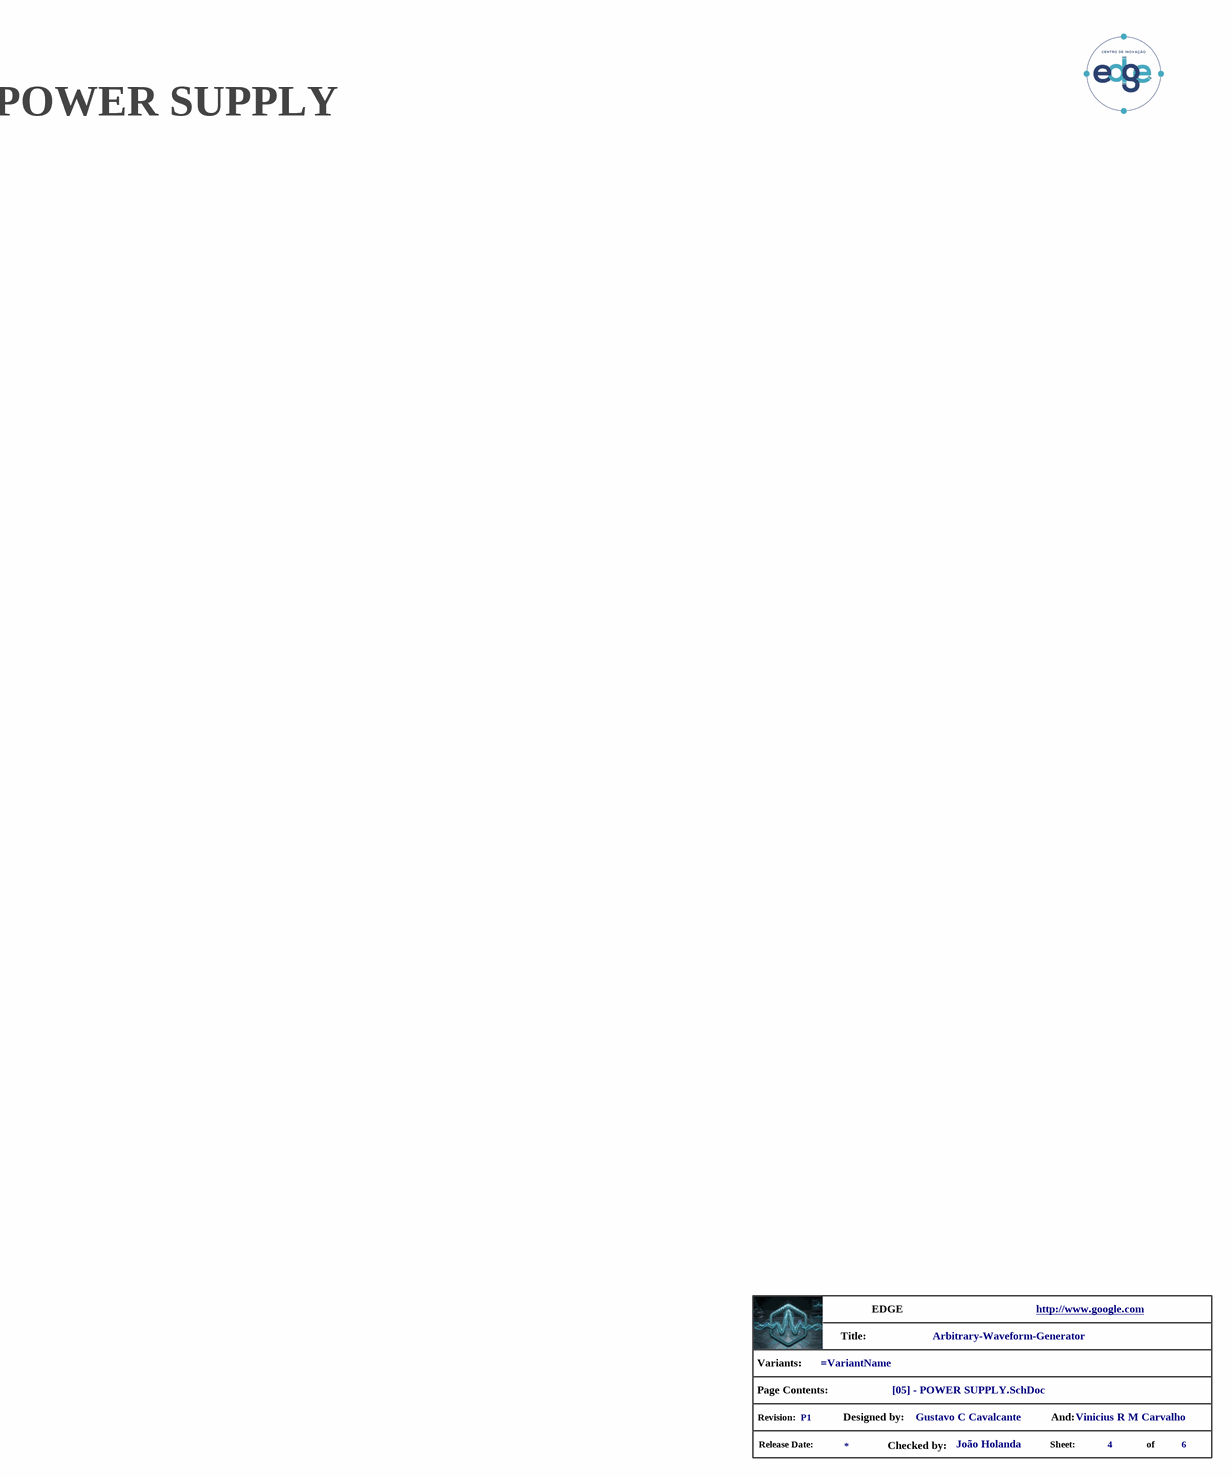
[diagram p1: [05] - POWER SUPPLY.SchDoc]

### Parts
(Parts that share a designator on the sheet are numbered #1, #2 ... from top to bottom, then left to right.)
*?#2  info_project  (value not drawn)  (graphical)

### Notes on the sheet
- POWER SUPPLY
- (in symbol info_project) Title:; Variants:; Page Contents:; Revision:; Designed by:; And:; Release Date:; Checked by:; Sheet:; of

### Library data of the parts
*?#2 = info_project: GRAPHICAL - Info Project

## Sheet Arbitrary-Waveform-Generator.SchDoc
size A4; DocumentNumber: 6; SheetNumber: 6; SheetTotal: 6
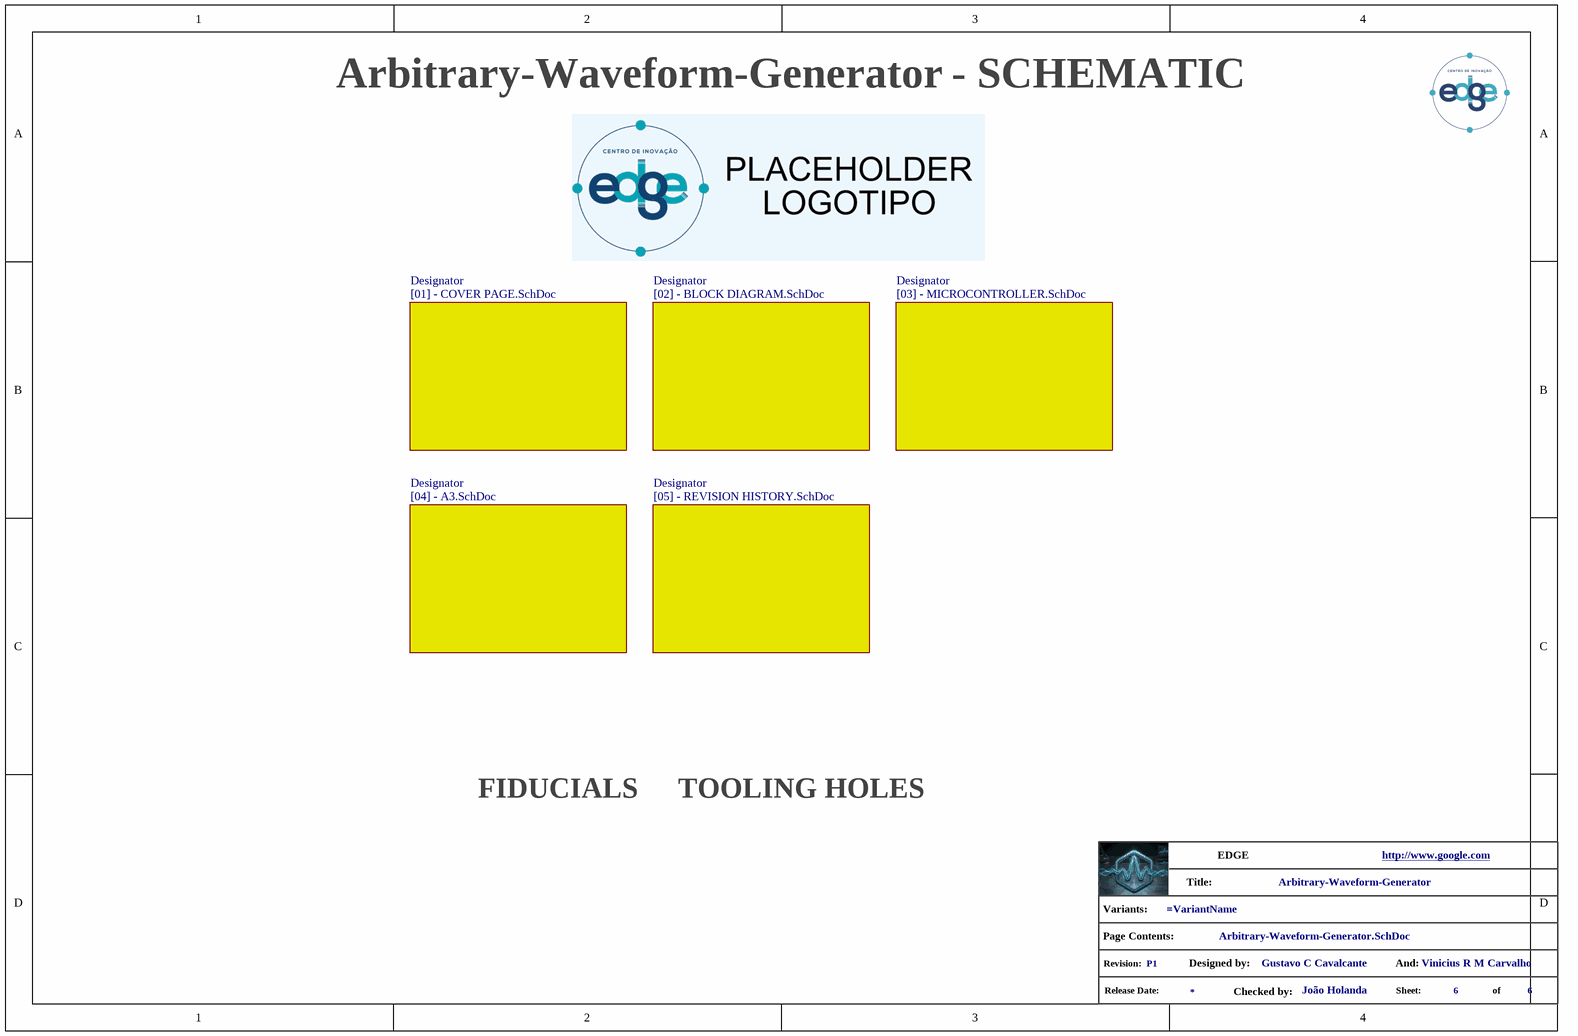
[diagram p2: Arbitrary-Waveform-Generator.SchDoc]

### Parts
(Parts that share a designator on the sheet are numbered #1, #2 ... from top to bottom, then left to right.)
*?#3  info_project  (value not drawn)  (graphical)

### Sub-sheets
Designator = [02] - BLOCK DIAGRAM.SchDoc: no entries
Designator = [03] - MICROCONTROLLER.SchDoc (file not in this document): no entries
Designator = [01] - COVER PAGE.SchDoc: no entries
Designator = [04] - A3.SchDoc (file not in this document): no entries
Designator = [05] - REVISION HISTORY.SchDoc (file not in this document): no entries

### Notes on the sheet
- - SCHEMATIC
- FIDUCIALS
- TOOLING HOLES
- (in symbol info_project) Title:; Variants:; Page Contents:; Revision:; Designed by:; And:; Release Date:; Checked by:; Sheet:; of

### Library data of the parts
*?#3 = info_project: GRAPHICAL - Info Project

## Sheet [02] - BLOCK DIAGRAM.SchDoc
size A2; DocumentNumber: 2; SheetNumber: 2; SheetTotal: 6; PageSetup: Record=PageOptions|CenterHorizontal=True|CenterVertical=True|PrintScale=0.52|XCorrection=1.00|YCorrection=1.00|PrintKind=1|BorderSize=5000000|LeftOffset=0|BottomOffset=0|Orientation=2|PaperLength=1000|PaperWidth=1000|Scale=100|PaperSource=4|PrintQuality=600|MediaType=1|DitherType=10|PrintScaleMode=1|PaperKind=A4|PaperIndex=9
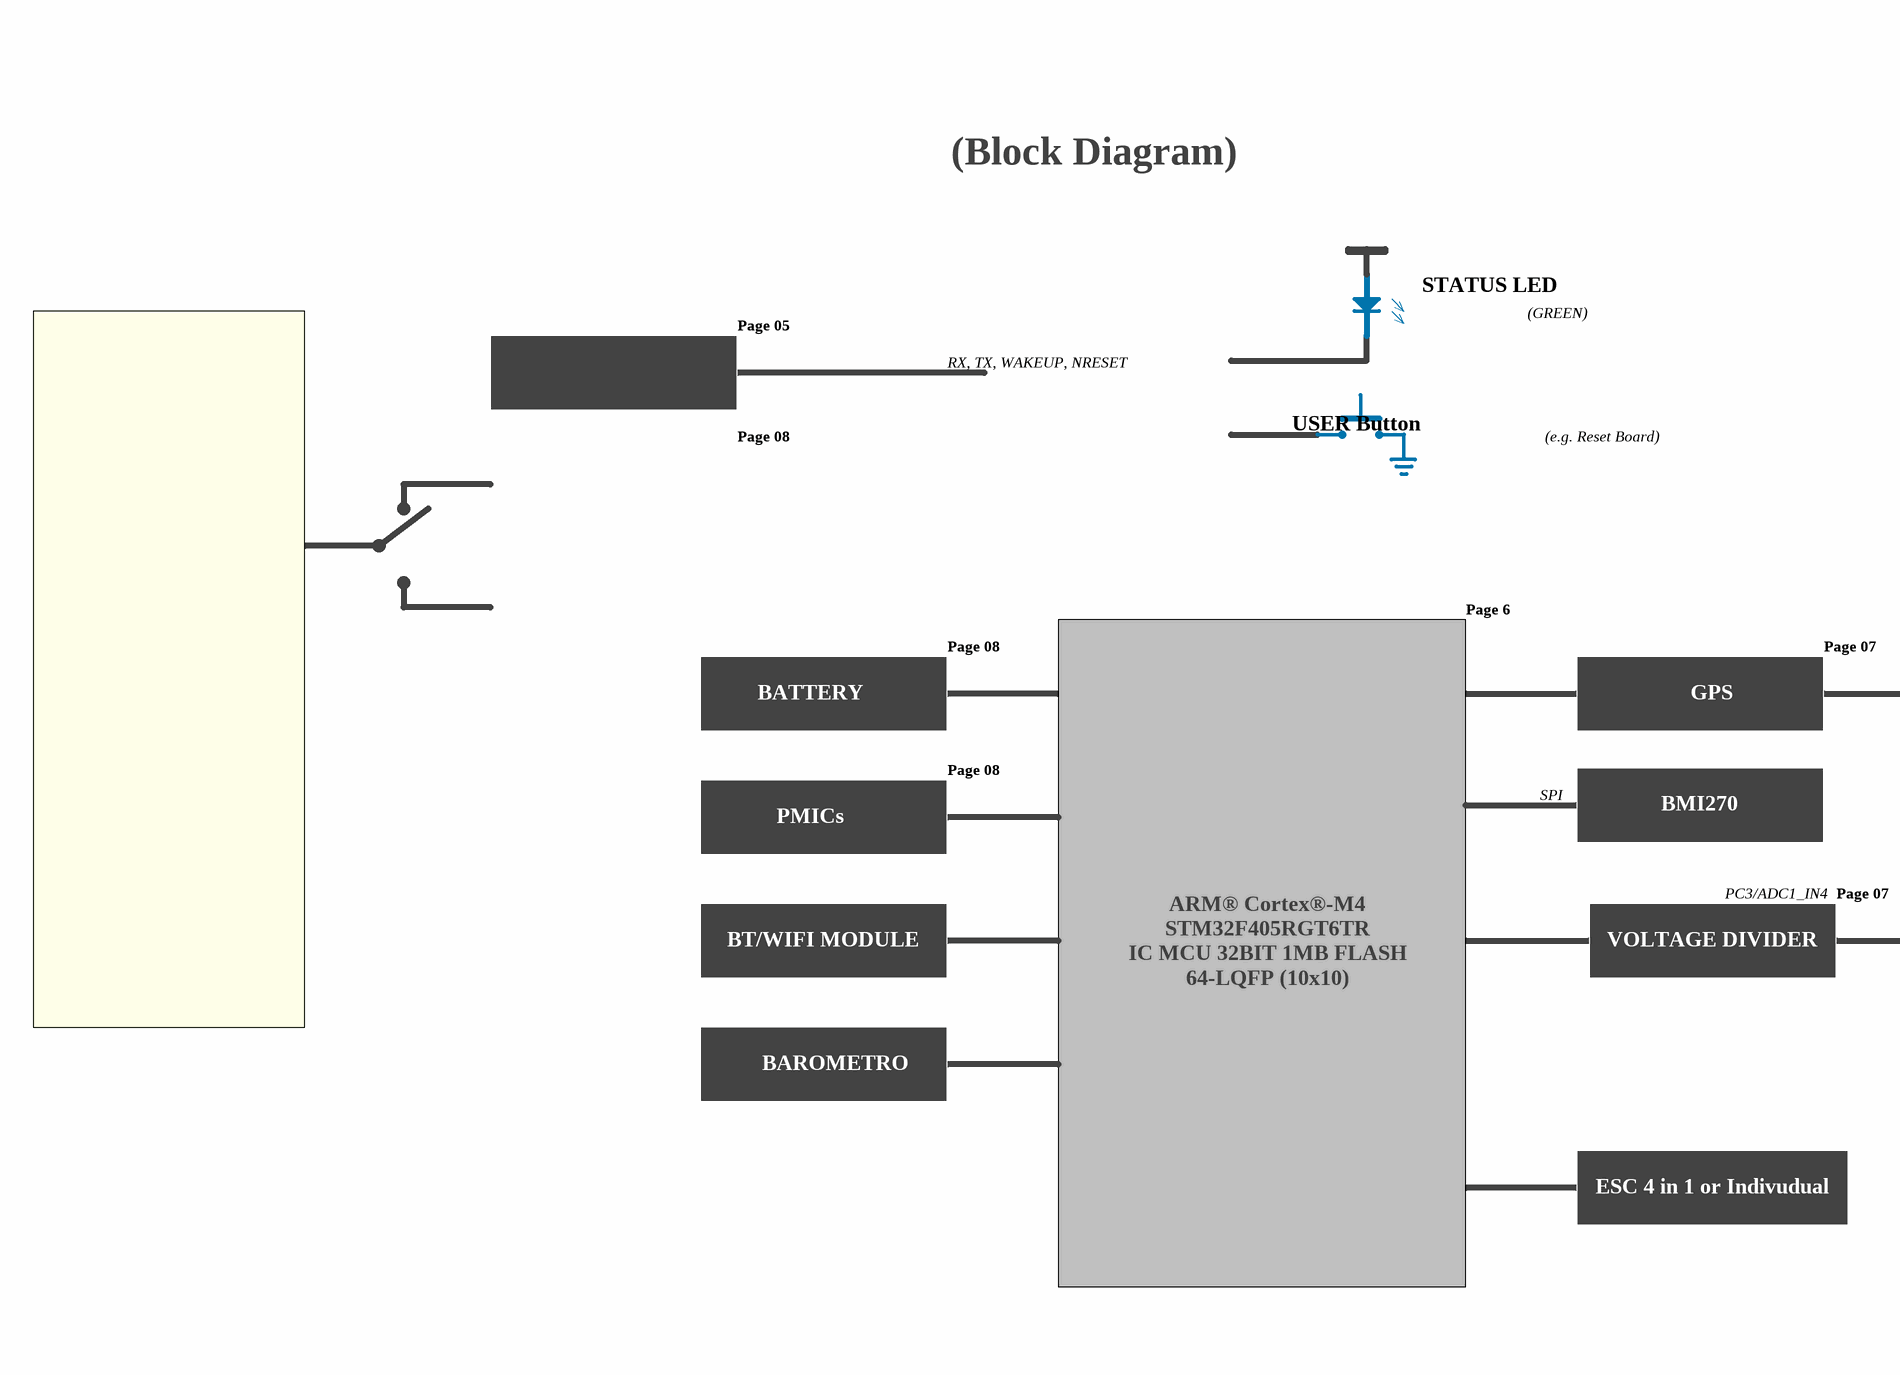
[diagram p3: [02] - BLOCK DIAGRAM.SchDoc, left]
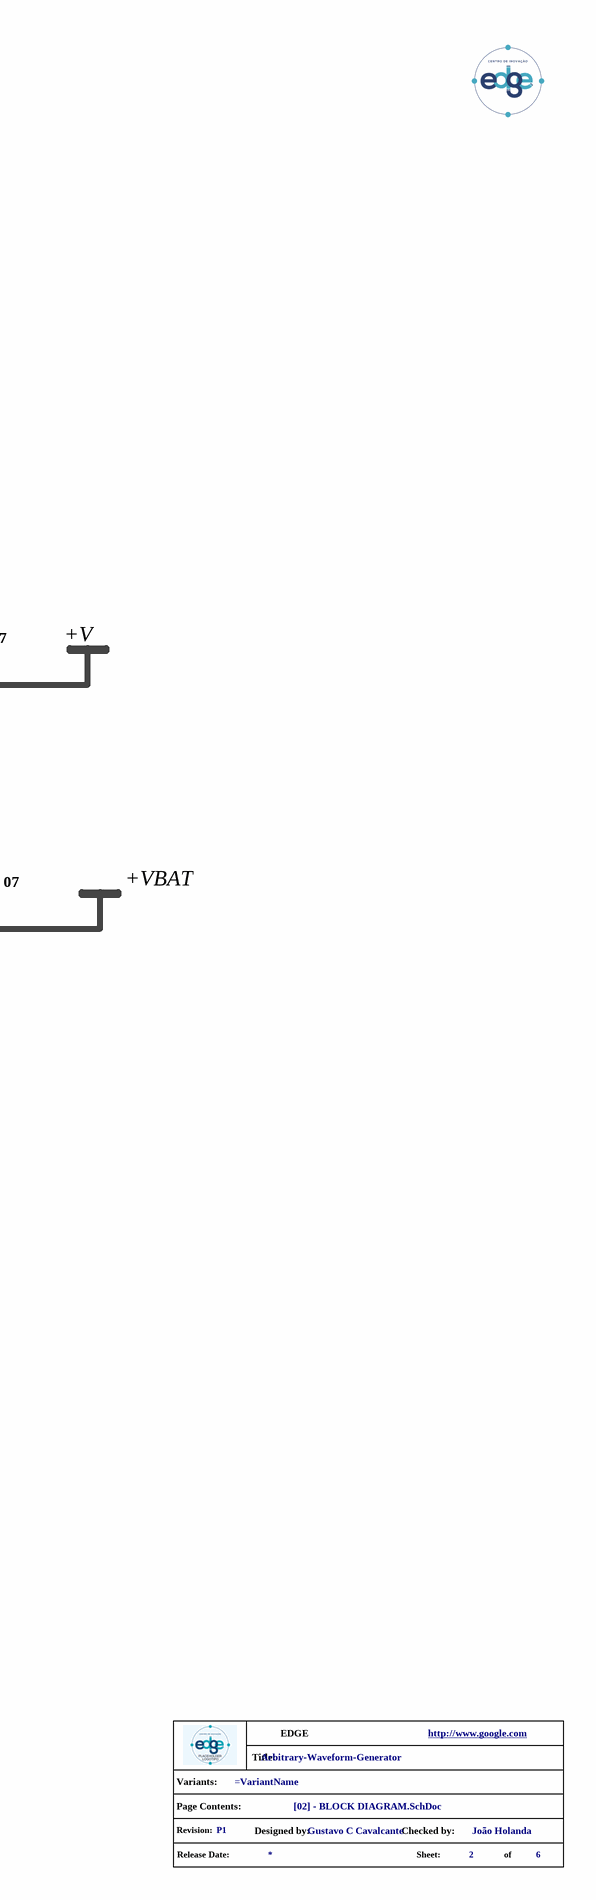
[diagram p4: [02] - BLOCK DIAGRAM.SchDoc, right]

### Parts
(Parts that share a designator on the sheet are numbered #1, #2 ... from top to bottom, then left to right.)
*?#4  info_project  (value not drawn)  (graphical)

### Notes on the sheet
- (Block Diagram)
- Page 05
- STATUS LED
- (GREEN)
- RX, TX, WAKEUP, NRESET
- USER Button
- Page 08
- (e.g. Reset Board)
- Page 6
- Page 07
- +V
- BATTERY
- GPS
- PMICs
- SPI
- BMI270
- ARM® Cortex®-M4
- PC3/ADC1_IN4
- +VBAT
- BT/WIFI MODULE
- STM32F405RGT6TR
- IC MCU 32BIT 1MB FLASH
- VOLTAGE DIVIDER
- 64-LQFP (10x10)
- BAROMETRO
- ESC 4 in 1 or Indivudual
- (in symbol info_project) Title:; Variants:; Page Contents:; Revision:; Designed by:; Checked by:; Release Date:; Sheet:; of

## Sheet [01] - COVER PAGE.SchDoc
size A3; DocumentNumber: 1; SheetNumber: 1; SheetTotal: 6
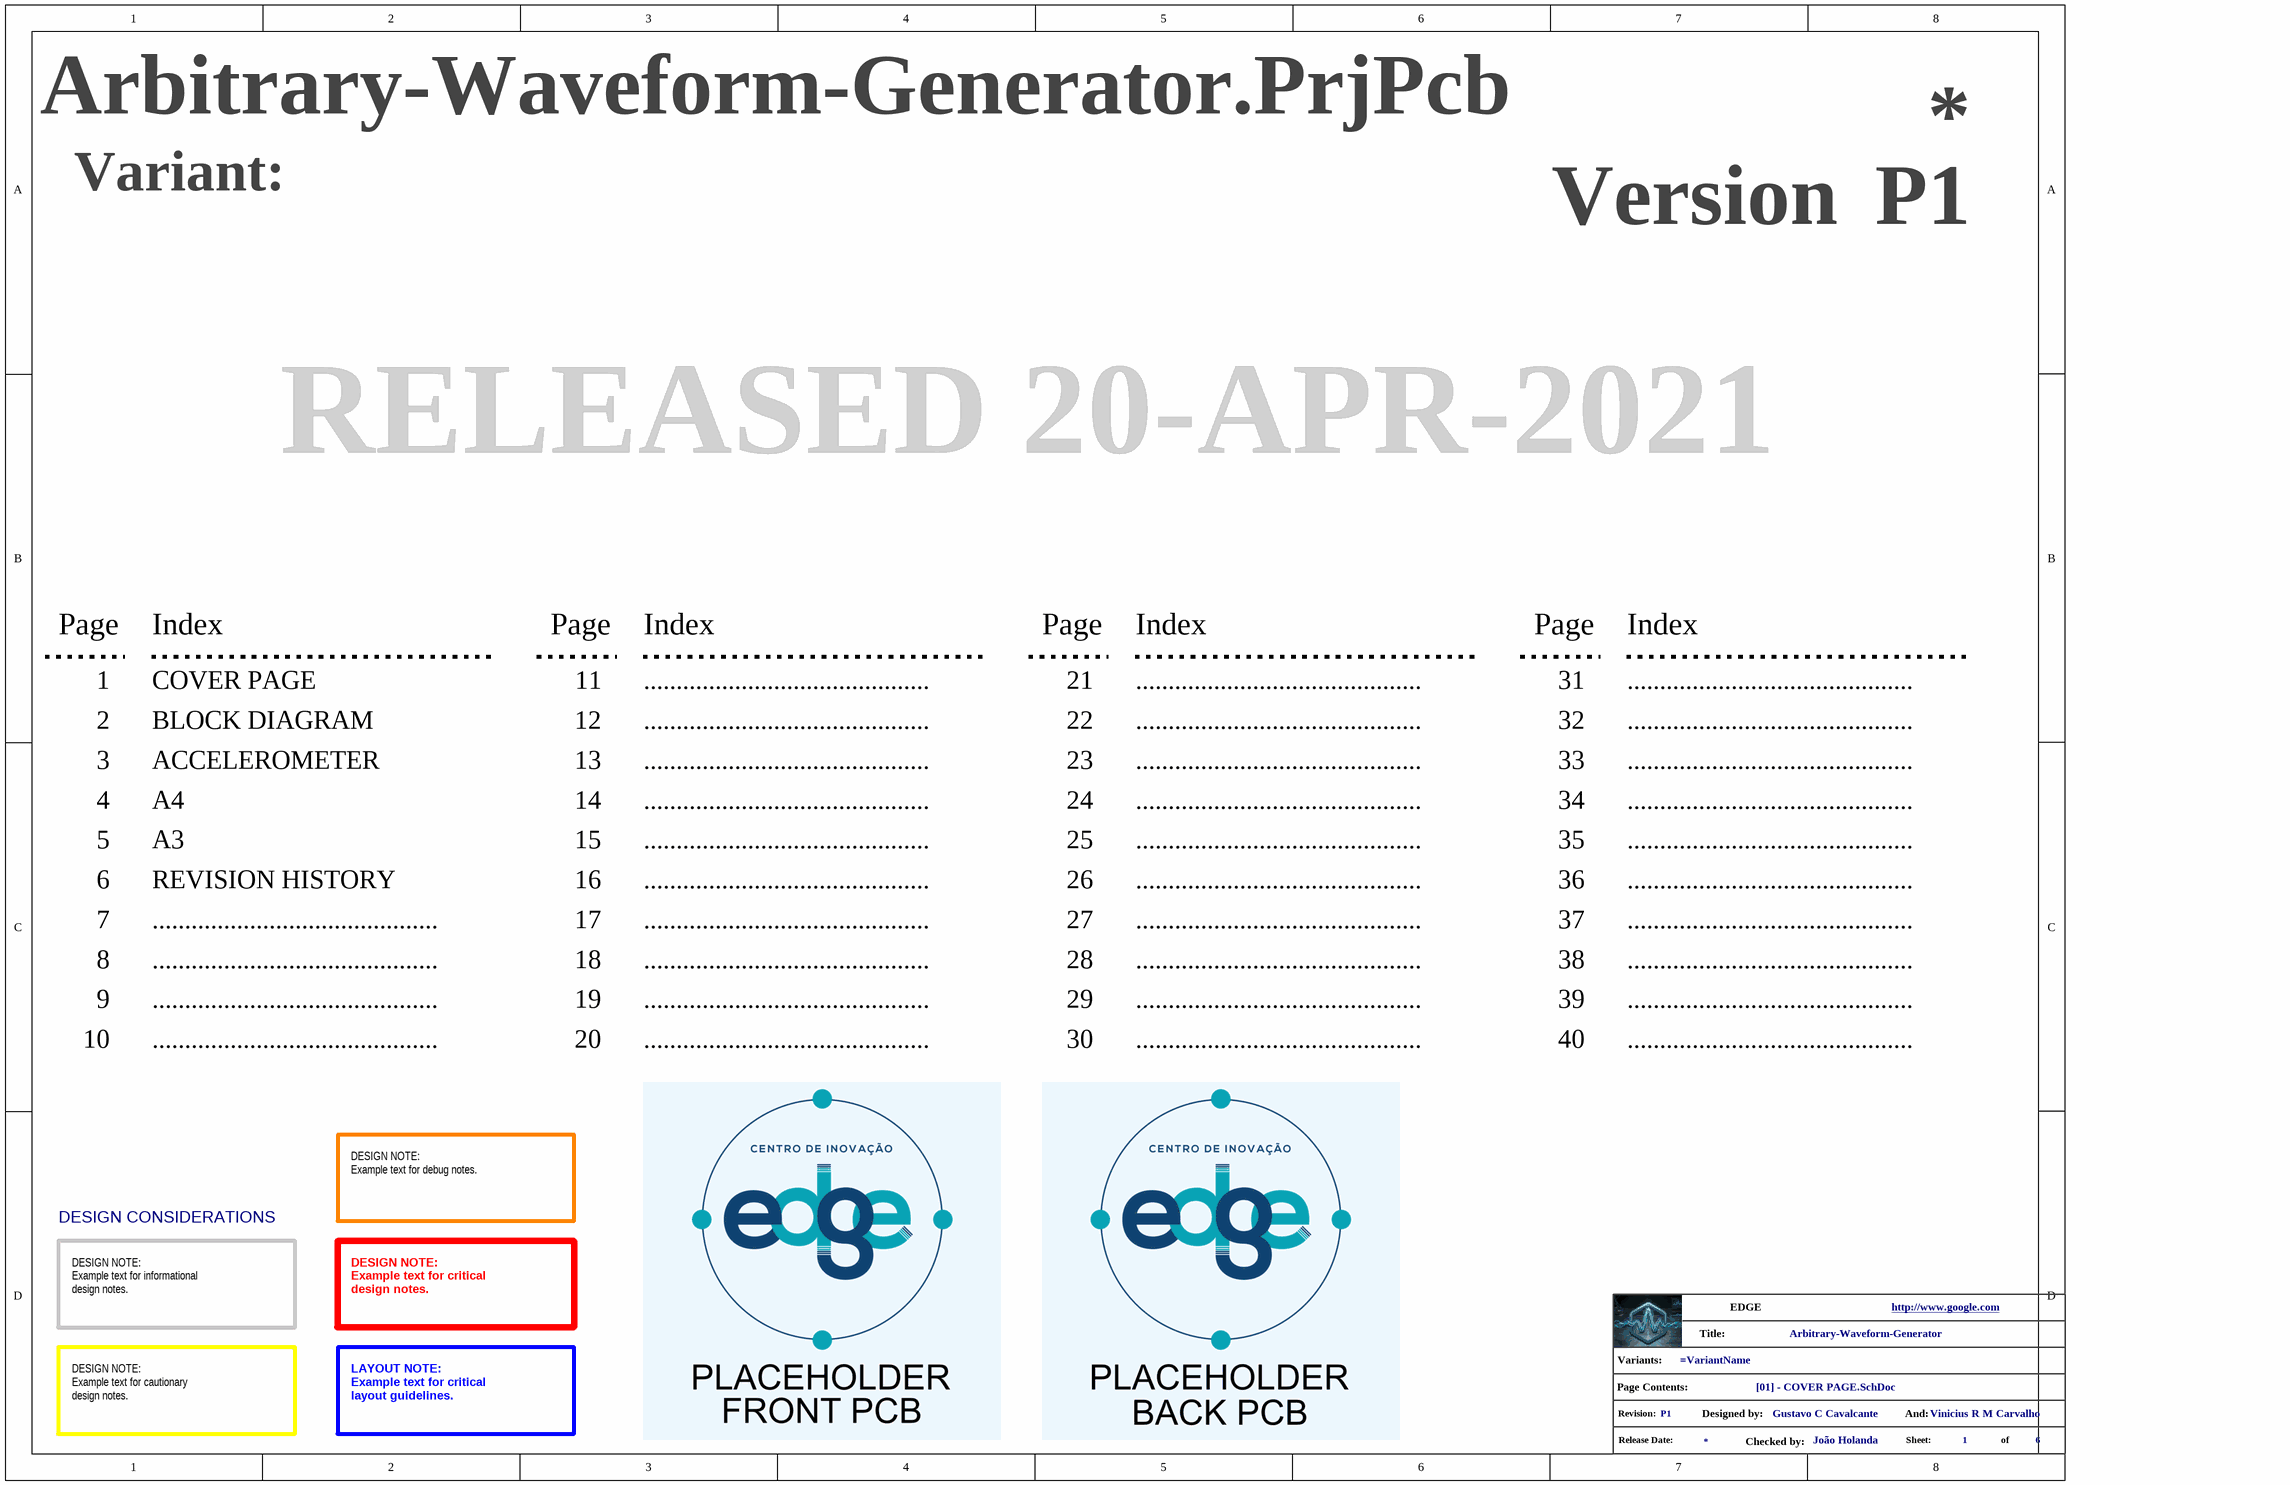
[diagram p5: [01] - COVER PAGE.SchDoc]

### Parts
(Parts that share a designator on the sheet are numbered #1, #2 ... from top to bottom, then left to right.)
*?#5  info_project  (value not drawn)  (graphical)

### Notes on the sheet
- Variant:
- Version
- RELEASED 20-APR-2021
- Page
- Index
- 1
- COVER PAGE
- 11
- ............................................
- 21
- 31
- 2
- 3
- BLOCK DIAGRAM
- ACCELEROMETER
- 12
- 13
- 22
- 23
- 32
- 33
- 4
- A4
- 14
- 24
- 34
- 5
- 6
- A3
- REVISION HISTORY
- 15
- 16
- 25
- 26
- 35
- 36
- 7
- 8
- 17
- 18
- 27
- 28
- 37
- 38
- 9
- 19
- 29
- 39
- 10
- 20
- 30
- 40
- DESIGN CONSIDERATIONS
- DESIGN NOTE:
  Example text for debug notes.
- DESIGN NOTE:
  Example text for informational
  design notes.
- DESIGN NOTE:
  Example text for critical
  design notes.
- DESIGN NOTE:
  Example text for cautionary
  design notes.
- LAYOUT NOTE:
  Example text for critical
  layout guidelines.
- (in symbol info_project) Title:; Variants:; Page Contents:; Revision:; Designed by:; And:; Release Date:; Checked by:; Sheet:; of

### Library data of the parts
*?#5 = info_project: GRAPHICAL - Info Project